# Altium schematic sheet Gate_Drive.SchDoc
size A4
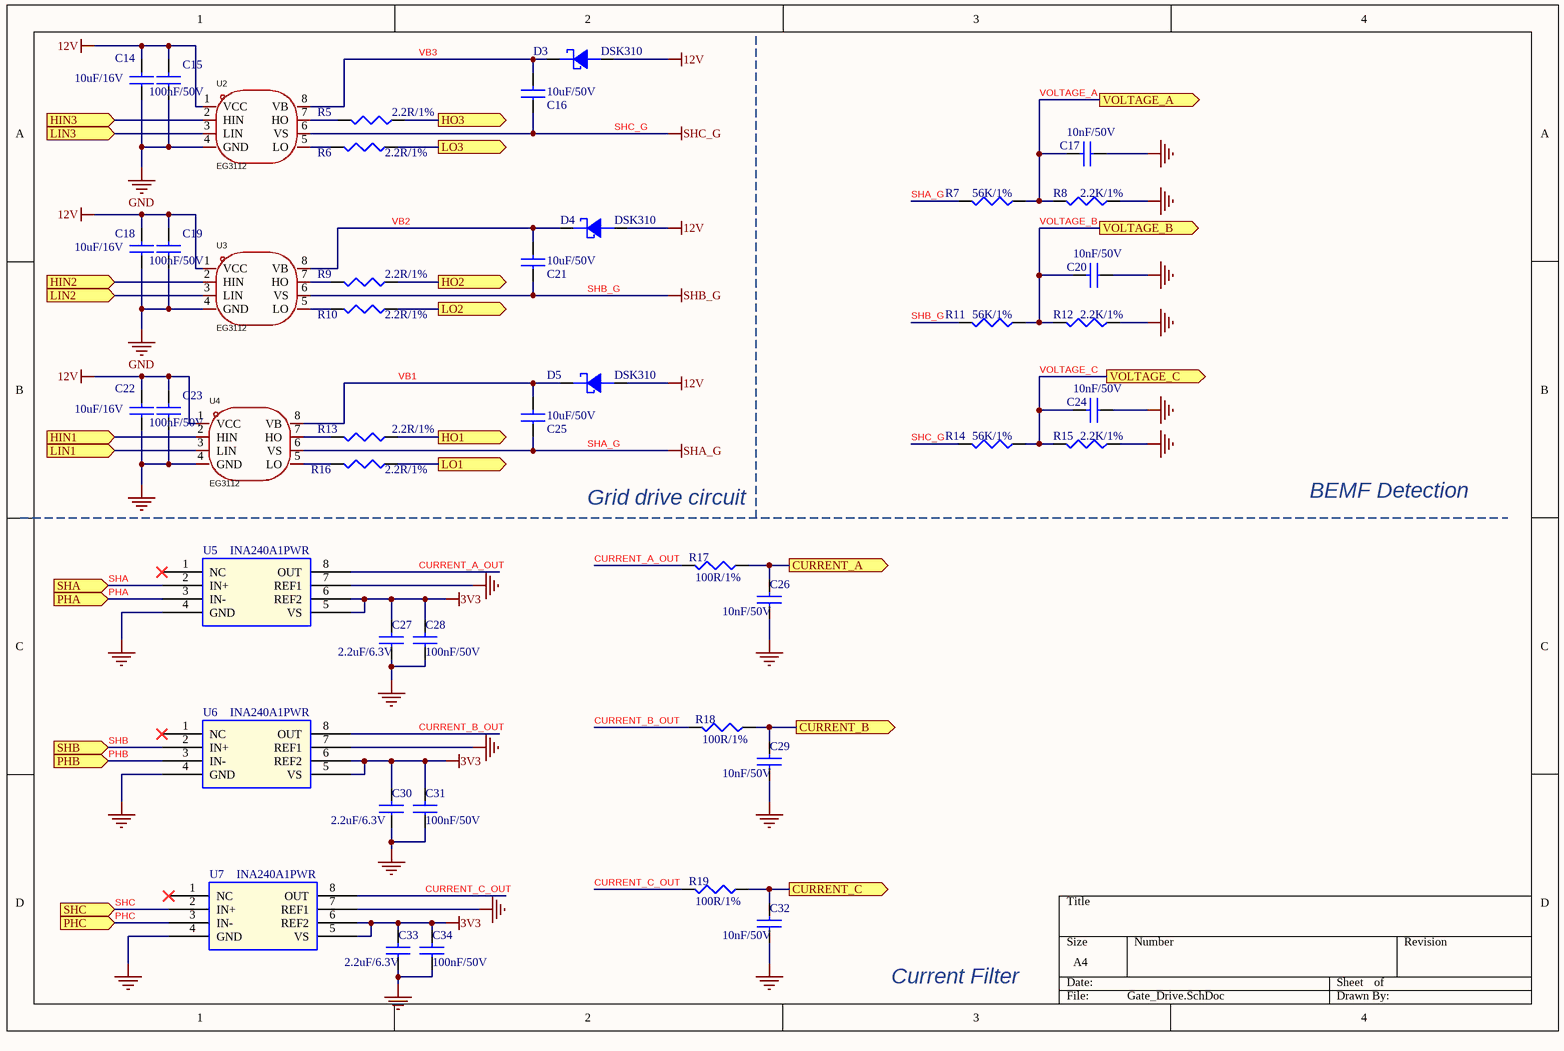
[diagram p0: Gate_Drive.SchDoc]

## Parts
C14  10uF/16V  [C0603]
C15  100nF/50V  [C0603]
C16  10uF/50V  [C0603]
C17  10nF/50V  [C0402]
C18  10uF/16V  [C0603]
C19  100nF/50V  [C0603]
C20  10nF/50V  [C0402]
C21  10uF/50V  [C0603]
C22  10uF/16V  [C0603]
C23  100nF/50V  [C0603]
C24  10nF/50V  [C0402]
C25  10uF/50V  [C0603]
C26  10nF/50V  [C0402]
C27  2.2uF/6.3V  [C0402]
C28  100nF/50V  [C0402]
C29  10nF/50V  [C0402]
C30  2.2uF/6.3V  [C0402]
C31  100nF/50V  [C0402]
C32  10nF/50V  [C0402]
C33  2.2uF/6.3V  [C0402]
C34  100nF/50V  [C0402]
D3  DSK310  [SOD-123F]
D4  DSK310  [SOD-123F]
D5  DSK310  [SOD-123F]
R5  2.2R/1%  [R0603]
R6  2.2R/1%  [R0603]
R7  56K/1%  [R0402]
R8  2.2K/1%  [R0402]
R9  2.2R/1%  [R0603]
R10  2.2R/1%  [R0603]
R11  56K/1%  [R0402]
R12  2.2K/1%  [R0402]
R13  2.2R/1%  [R0603]
R14  56K/1%  [R0402]
R15  2.2K/1%  [R0402]
R16  2.2R/1%  [R0603]
R17  100R/1%  [R0402]
R18  100R/1%  [R0402]
R19  100R/1%  [R0402]
U2  EG3112  [SOIC-8_L4.9-W3.9-P1.27-LS6.0-BL]
U3  EG3112  [SOIC-8_L4.9-W3.9-P1.27-LS6.0-BL]
U4  EG3112  [SOIC-8_L4.9-W3.9-P1.27-LS6.0-BL]
U5  INA240A1PWR  [TSSOP-8]
U6  INA240A1PWR  [TSSOP-8]
U7  INA240A1PWR  [TSSOP-8]

## Ports
CURRENT_A (out, see VESC_75100[3B]), CURRENT_B (out, see VESC_75100[3B]), CURRENT_C (out, see VESC_75100[3B]), HIN1 (in, see VESC_75100[3A]), HIN2 (in, see VESC_75100[3B]), HIN3 (in, see VESC_75100[3B]), HO1 (out, see VESC_75100[3A]), HO2 (out, see VESC_75100[3B]), HO3 (out, see VESC_75100[3B]), LIN1 (in, see VESC_75100[3B]), LIN2 (in, see VESC_75100[3B]), LIN3 (in, see VESC_75100[3B]), LO1 (out, see VESC_75100[3B]), LO2 (out, see VESC_75100[3B]), LO3 (out, see VESC_75100[3B]), PHA (in, see VESC_75100[3B]), PHB (in, see VESC_75100[3B]), PHC (in, see VESC_75100[3B]), SHA (in, see VESC_75100[3B]), SHB (in, see VESC_75100[3B]), SHC (in, see VESC_75100[3B]), VOLTAGE_A (out, see VESC_75100[3B]), VOLTAGE_B (out, see VESC_75100[3B]), VOLTAGE_C (out, see VESC_75100[3B])

## Nets
3V3: C27.2 C28.2 C30.2 C31.2 C33.2 C34.2 U5.5(VS) U5.6(REF2) U6.5(VS) U6.6(REF2) U7.5(VS) U7.6(REF2)
12V: C14.2 C15.2 C18.2 C19.2 C22.2 C23.2 D3.2(A) D4.2(A) D5.2(A) U2.1(VCC) U3.1(VCC) U4.1(VCC)
GND: C14.1 C15.1 C17.1 C18.1 C19.1 C20.1 C22.1 C23.1 C24.1 C26.1 C27.1 C28.1 C29.1 C30.1 C31.1 C32.1 C33.1 C34.1 R8.1 R12.1 R15.1 U2.4(GND) U3.4(GND) U4.4(GND) U5.4(GND) U5.7(REF1) U6.4(GND) U6.7(REF1) U7.4(GND) U7.7(REF1)
SHA_G: C25.1 R7.2 U4.6(VS)
SHB_G: C21.1 R11.2 U3.6(VS)
SHC_G: C16.1 R14.2 U2.6(VS)
CURRENT_A: C26.2 R17.1 ; port CURRENT_A
CURRENT_A_OUT: R17.2 U5.8(OUT)
CURRENT_B: C29.2 R18.1 ; port CURRENT_B
CURRENT_B_OUT: R18.2 U6.8(OUT)
CURRENT_C: C32.2 R19.1 ; port CURRENT_C
CURRENT_C_OUT: R19.2 U7.8(OUT)
HIN1: U4.2(HIN) ; port HIN1
HIN2: U3.2(HIN) ; port HIN2
HIN3: U2.2(HIN) ; port HIN3
HO1: R13.1 ; port HO1
HO2: R9.1 ; port HO2
HO3: R5.1 ; port HO3
LIN1: U4.3(LIN) ; port LIN1
LIN2: U3.3(LIN) ; port LIN2
LIN3: U2.3(LIN) ; port LIN3
LO1: R16.1 ; port LO1
LO2: R10.1 ; port LO2
LO3: R6.1 ; port LO3
PHA: U5.3(IN-) ; port PHA
PHB: U6.3(IN-) ; port PHB
PHC: U7.3(IN-) ; port PHC
SHA: U5.2(IN+) ; port SHA
SHB: U6.2(IN+) ; port SHB
SHC: U7.2(IN+) ; port SHC
VB1: C25.2 D5.1(K) U4.8(VB)
VB2: C21.2 D4.1(K) U3.8(VB)
VB3: C16.2 D3.1(K) U2.8(VB)
VOLTAGE_A: C17.2 R7.1 R8.2 ; port VOLTAGE_A
VOLTAGE_B: C20.2 R11.1 R12.2 ; port VOLTAGE_B
VOLTAGE_C: C24.2 R14.1 R15.2 ; port VOLTAGE_C
NetR5_2: R5.2 U2.7(HO)
NetR6_2: R6.2 U2.5(LO)
NetR9_2: R9.2 U3.7(HO)
NetR10_2: R10.2 U3.5(LO)
NetR13_2: R13.2 U4.7(HO)
NetR16_2: R16.2 U4.5(LO)

Not connected (* = marked no-connect by the designer): U5 1(NC)*; U6 1(NC)*; U7 1(NC)*

## Notes on the sheet
- Grid drive circuit
- BEMF Detection
- Current Filter

## Library data of the parts
C14-C34 = CAP NP
  C14-C16 C18 C19 C21-C23 C25: PCB Footprint: C0603
  C17 C20 C24 C26-C34: PCB Footprint: C0402
D3-D5 = DIODE SCHOTTKY21: PCB Footprint: SOD-123F
R5 R6 R9 R10 R13 R16 = RESISTOR: PCB Footprint: R0402
R7 R8 R11 R12 R14 R15 R17-R19 = RESISTOR: PCB Footprint: R0402
U2-U4 = EG3112: Manufacturer: EG(屹晶微); Add into BOM: yes; Symbol: EG3112; Device: EG3112; LCSC Part Name: EG3112; Supplier Part: C111908; Manufacturer Part: EG3112; Supplier Footprint: SOIC-8; JLCPCB Part Class: Extended Part; Datasheet: https://atta.szlcsc.com/upload/public/pdf/source/20230725/3992D5BD05E91E0CBB5D3EE72F4B3B26.pdf; Supplier: LCSC; Convert to PCB: yes
U5-U7 = INA240A1PWR: PCB Footprint: TSSOP-8